# Altium schematic sheet Processor.SchDoc
size A; SheetNumber: 2; SheetTotal: 5
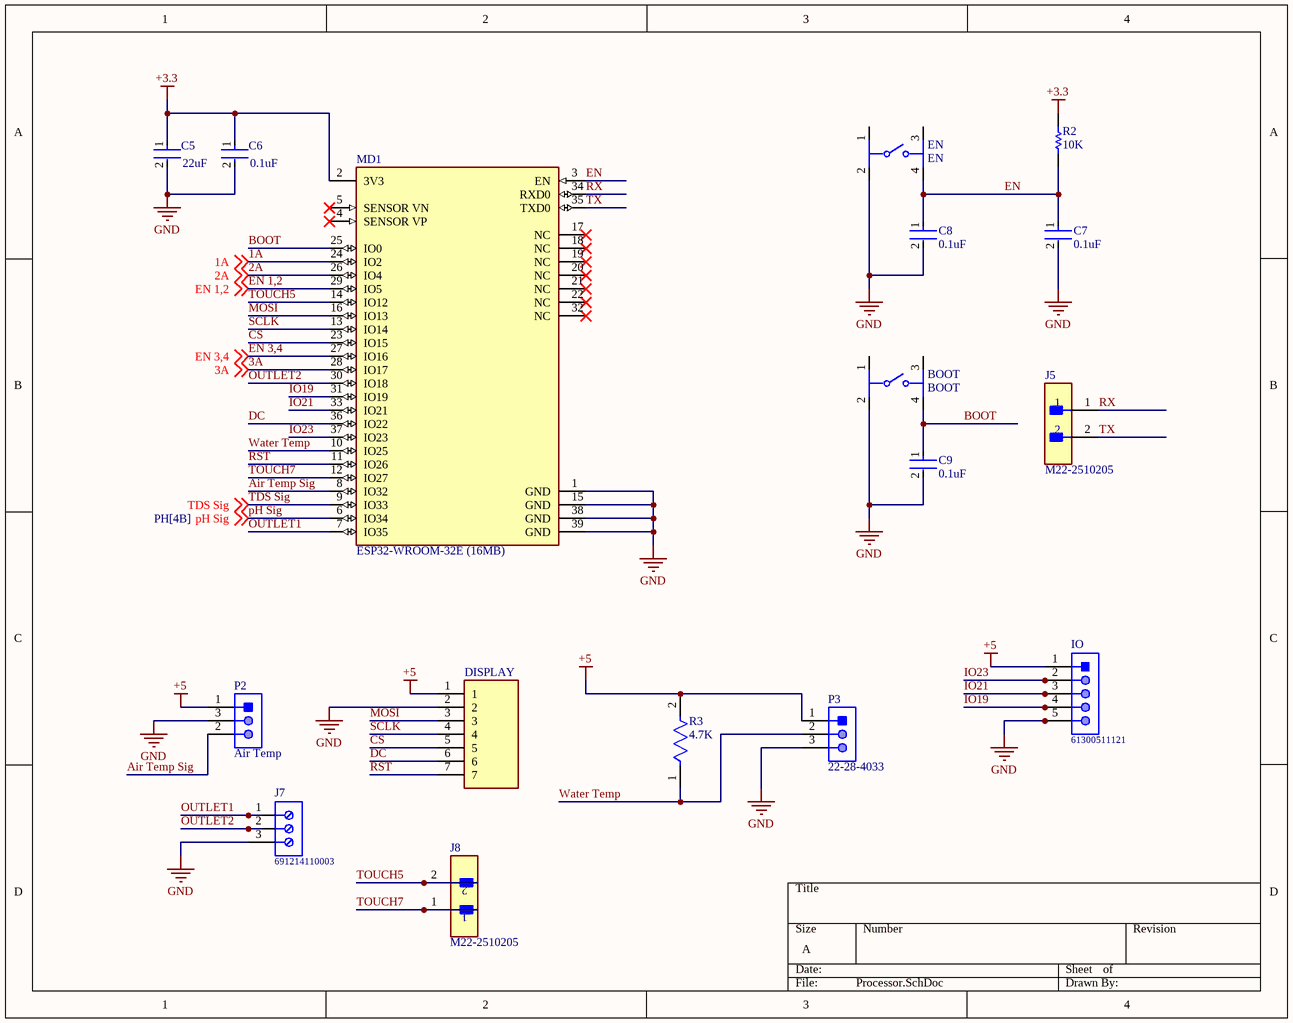
[diagram p0: Processor.SchDoc]

## Parts
BOOT  BOOT  [FP-1825910-2-0]
C5  22uF  [FP-GRM21B-0_15-MFG]
C6  0.1uF  [FP-C0805C-DN-MFG]
C7  0.1uF  [FP-C0805C-DN-MFG]
C8  0.1uF  [FP-C0805C-DN-MFG]
C9  0.1uF  [FP-C0805C-DN-MFG]
DISPLAY  (no value)  [SHDR7W50P0X200_1X7_1590X450X600P]
EN  EN  [FP-1825910-2-0]
IO  61300511121  [61300511121]
J5  M22-2510205  [FP-M22-2510205-MFG]
J7  691214110003  [691214110003]
J8  M22-2510205  [FP-M22-2510205-MFG]
MD1  ESP32-WROOM-32E (16MB)  [FP-ESP32-WROOM-32E_16MB-MFG]
P2  Air Temp  [MOLX-22-28-4033_V]
P3  22-28-4033  [MOLX-22-28-4033_V]
R2  10K  [RESC1609X50X30NL8T20]
R3  4.7K  [FP-CRCW0805-e3-IPC_B]

## Nets
+3.3: C5.1 C6.1 MD1.2(3V3) R2.1
+5: DISPLAY.1 IO.1 P2.1 P3.1 R3.2
GND: BOOT.2 C5.2 C6.2 C7.2 C8.2 C9.2 DISPLAY.2 EN.2 IO.5 J7.3 MD1.1(GND) MD1.15(GND) MD1.38(GND) MD1.39(GND) P2.3 P3.3
1A: MD1.24(IO2) ; off-sheet 1A
2A: MD1.26(IO4) ; off-sheet 2A
3A: MD1.28(IO17) ; off-sheet 3A
Air Temp Sig: MD1.8(IO32) P2.2
BOOT: BOOT.4 C9.1 MD1.25(IO0)
CS: DISPLAY.5 MD1.23(IO15)
DC: DISPLAY.6 MD1.36(IO22)
EN: C7.1 C8.1 EN.4 MD1.3(EN) R2.2
EN 1,2: MD1.29(IO5) ; off-sheet EN 1,2
EN 3,4: MD1.27(IO16) ; off-sheet EN 3,4
IO19: IO.4 MD1.31(IO19)
IO21: IO.3 MD1.33(IO21)
IO23: IO.2 MD1.37(IO23)
MOSI: DISPLAY.3 MD1.16(IO13)
OUTLET1: J7.1 MD1.7(IO35)
OUTLET2: J7.2 MD1.30(IO18)
pH Sig: MD1.6(IO34) ; off-sheet pH Sig
RST: DISPLAY.7 MD1.11(IO26)
RX: J5.1 MD1.34(RXD0)
SCLK: DISPLAY.4 MD1.13(IO14)
TDS Sig: MD1.9(IO33) ; off-sheet TDS Sig
TOUCH5: J8.2 MD1.14(IO12)
TOUCH7: J8.1 MD1.12(IO27)
TX: J5.2 MD1.35(TXD0)
Water Temp: MD1.10(IO25) P3.2 R3.1

Not connected (* = marked no-connect by the designer): BOOT 1 3; EN 1 3; MD1 4(SENSOR_VP)* 5(SENSOR_VN)* 17(NC)* 18(NC)* 19(NC)* 20(NC)* 21(NC)* 22(NC)* 32(NC)*

## Library data of the parts
BOOT EN = CMP-03407-000004-1: SWITCH TACTILE SPST-NO 0.05A 24V; Manufacturer: TE; Manufacturer Part Number: 1825910-2; Contact Current Rating: 50mA; Operating Force: 160gf; Contact Resistance: 100mΩ; Electromechanical Life: 100000Cycles; Package: 0; ComponentLink2Description: Datasheet; Digikey Description: SWITCH TACTILE SPST-NO 0.05A 24V; Octopart: https://octopart.com/1825910-2-te+connectivity-42270502; Temperature Range Low: -35°C; Temperature Range High: +85°C; Lead Free: Yes; Device Class L2: Switches; Automotive: No; Temperature: -35°C to +85°C; Device Class L1: Electromechanical; Category: Switch; ComponentLink2URL: https://www.te.com/commerce/DocumentDelivery/DDEController?Action=showdoc&DocId=Customer+Drawing%7F1825910%7FC10%7Fpdf%7FEnglish%7FENG_CD_1825910_C10.pdf%7F1825910-2; Mount: Through Hole; RoHS: TRUE; Height: 4.6mm; Device Class L3: Tactile Switches; Voltage Rating Dc: 24V; Throw Configuration: SPST-NO
C5 = CMP-2007-03385-2: Chip Multilayer Ceramic Capacitors for General Purpose, 0805, 22uF, X5R, 15%, 20%, 6.3V; Material: Ceramic; Max Operating Temperature: 85°C; Voltage: 6.3V; Min Operating Temperature: -55°C; Case/Package: 0805; Thickness: 0.053inch; Dielectric: X5R; Packaging: Tape and Reel; Depth: 1.25mm; Termination: SMD/SMT; Voltage Rating (DC): 6.3V; Radiation Hardening: No; Tolerance: 20%; Mount: Surface Mount; Lead Free: Lead Free; Package Quantity: 1; REACH SVHC: No SVHC; Voltage Rating: 6.3V; Capacitance: 22uF; Length: 2mm; Case Code (Imperial): 0805; Case Code (Metric): 2012; Width: 0.049inch; Height: 1.25mm
C6-C9 = CMP-2007-00279-2: CAP CER 0.1UF 50V X7R 0805; Manufacturer Part Number: C0805C104K5RACTU; Manufacturer: KEMET; Value: 0.10 μF; Tolerance: 0.1; Temperature Coefficient: 30ppm/°C; Material: Ceramic; Device Class L2: Capacitors; Temperature Range Low: -55°C; Voltage Rating: 50 V; Digikey Description: CAP CER 0.1UF 50V X7R 0805; Category: Cap; ComponentLink2Description: Datasheet; Octopart: https://octopart.com/c0805c104k5ractu-kemet-143926; RoHS: TRUE; ComponentLink2URL: https://content.kemet.com/datasheets/KEM_C1003_C0G_SMD.pdf; Temperature Characteristic: X7R; Temperature: -55°C to +125°C; Height: 0.88mm; Temperature Range High: +125°C; Device Class L1: Passive Components; Automotive: No; Lead Free: Yes; Ipc Land Pattern Name: CAPC200125X78; Device Class L3: Ceramic Capacitors; Mouser Description: Cap Ceramic 0.1uF 50V X7R 10% SMD 2.0 x 1.2 mm 125 C Paper T/R; Capacitance: 0.10 μF; Package: C0805C-DN
DISPLAY = B7B-PH-K-S_LF__SN_: Connector; Manufacturer_Name: JST (JAPAN SOLDERLESS TERMINALS); Manufacturer_Part_Number: B7B-PH-K-S(LF)(SN); Datasheet Link: http://uk.rs-online.com/web/p/products/8201440; Height: 6mm; Arrow Part Number: B7B-PH-K-S(LF)(SN); Arrow Price/Stock: https://www.arrow.com/en/products/b7b-ph-k-s-lf-sn/jst-manufacturing
IO = CMP-1502-01068-1: THT Vertical Pin Header WR-PHD, Pitch 2.54 mm, Single Row, 5 pins; Manufacturer: Wurth Elektronik; Pin Number: 5; Contact Resistance: 20mOhm; Working Voltage: 250VAC; Pitch: 2.54mm; Withstanding Voltage: 500VAC; Rated Current: 3A; Gender: Male; Datasheet URL: https://katalog.we-online.de/em/datasheet/6130xx11121.pdf; Orientation: Vertical; Mounting Technology: THT; Row Number: Single; Package Reference: 61300511121; Publisher: WurthElektronik; Part Number: 61300511121; Packaging: Bag; Manufacturer URL: http://www.we-online.de; Operating Temperature: -40to105degC
J5 J8 = CMP-15831-000005-1: CONN HEADER VERT 2POS 2MM; Manufacturer: Harwin; Conn Gender: Male; Current Rating: 2A; Number Of Contacts: 2; Conn Orientation: Vertical; Temperature Range Low: -40°C; Device Class L1: Connectors; ComponentLink2URL: https://cdn.harwin.com/pdfs/C018XX_M22_Series_Connectors.pdf; Temperature Range High: +105°C; Pitch: 2mm; Number Of Rows: 1; Temperature: -40°C to +105°C; Automotive: No; Device Class L3: unset; Octopart: https://octopart.com/m22-2510205-harwin-2538221; Mouser Description: Headers & Wire Housings 2 PIN SIL VERTICAL GOLD PIN HEADER; Height: 5.45mm; Category: Conn; Digikey Description: CONN HEADER VERT 2POS 2MM; Contact Material: Gold,Nickel; Lead Free: Yes; ComponentLink2Description: Datasheet; Manufacturer Part Number: M22-2510205; Device Class L2: Headers and Wire Housings; Package: 0; Footprint Url: https://cdn.harwin.com/pdfs/M22-251.pdf; RoHS: TRUE
J7 = CMP-1502-02466-1: Serie 2141 - 3.50 mm Horizontal Entry Modular with Rising Cage Clamp WR-TBL, 3 pin; Manufacturer: Wurth Elektronik; Pin Number: 3; Pitch: 3.50mm; Package Reference: 691214110003; Mounting Technology: THT; Part Number: 691214110003; Manufacturer URL: http://www.we-online.de; Packaging: Box; Operating Temperature: -40to105degC; Publisher: WurthElektronik; Datasheet URL: http://katalog.we-online.de/em/datasheet/6912141100xx.pdf
MD1 = CMP-194065-000027-1: RX TXRX MOD WIFI TRACE ANT SMD
P2 P3 = CMP-1676-00001-5: Male Header, Pitch 2.54 mm, 1 x 3 Position, Height 8.38 mm, Tail Length 3.18 mm, RoHS, Bulk; Manufacturer: Molex; Rows: 1; Voltage Rating: 250 V; Current Rating: 4 A; Min Operating Temperature: 0 degC; Lead Pitch: 0.1 inch; Packaging: Bulk; Contact Finish: Gold; RoHSCompliant: true; Contact Material: Brass; PackageReference: 22-28-4033; REACH SVHC: Unknown; PackageDescription: Male Header, Pitch 2.54 mm, 1 x 3 Position, Height 8.38 mm, Tail Length 3.18 mm; ComponentLink2URL: http://www.molex.com/pdm_docs/sd/022284033_sd.pdf; Height: 8.38 mm; Mounting Technology: Through Hole; ComponentLink1Description: Manufacturer URL; Length: 7.62 mm; Mount: Through Hole; DatasheetVersion: Rev. G, 01/2012; Max Operating Temperature: 75 degC; ComponentLink2Description: Datasheet; Colour: Black; Pins: 3; Contact Plating: Gold; Package Quantity: 1; ComponentLink1URL: http://www.molex.com/
R2 = CMP-1666-00005-4: Chip Resistor, 10 KOhm, +/- 1%, 100 mW, -55 to 155 degC, 0603 (1608 Metric), RoHS, Tape and Reel; Manufacturer: Vishay Semiconductor; Voltage Rating: 75 V; Max Operating Temperature: 155 degC; PackageDescription: 2-Pin Surface Mount Device, Body 1.575 x 0.85 mm; ComponentLink1Description: Manufacturer URL; RoHSCompliant: true; PackageReference: 0603; REACH SVHC: Unknown; Length: 1.55 mm; DatasheetVersion: 06/2012; Packaging: Tape and Reel; Min Operating Temperature: -55 degC; Mounting Technology: Surface Mount; ComponentLink2URL: https://datasheet.ciiva.com/11809/0900766b80d98afc-11809037.pdf; Height: 0.45 mm; ComponentLink2Description: Datasheet; Package Quantity: 5000; ComponentLink1URL: http://www.vishay.com/
R3 = CMP-2100-03615-2: RES Thick Film, 4.7kΩ, 1%, 0.125W, 100ppm/°C, 0805; Max Power Dissipation: 125mW; Resistance: 4.7kR; Voltage Rating: 150V; Termination: SMD/SMT; Weight: 0.000194oz; Case/Package: 0805; Number of Terminations: 2; Min Operating Temperature: -55°C; Case Code (Metric): 2012; Package Quantity: 10; Depth: 1.25mm; Military Standard: Not; Composition: Thick Film; Radiation Hardening: No; Contact Plating: Tin; Height: 0.45mm; Power Rating: 125mW; Features: Automotive AEC-Q200; Tolerance: 1%; Packaging: Tape and Reel; Max Operating Temperature: 155°C; Length: 2mm; Case Code (Imperial): 0805; Voltage Rating (DC): 150V; Width: 1.25mm; Temperature Coefficient: 100ppm/°C; Lead Free: Lead Free